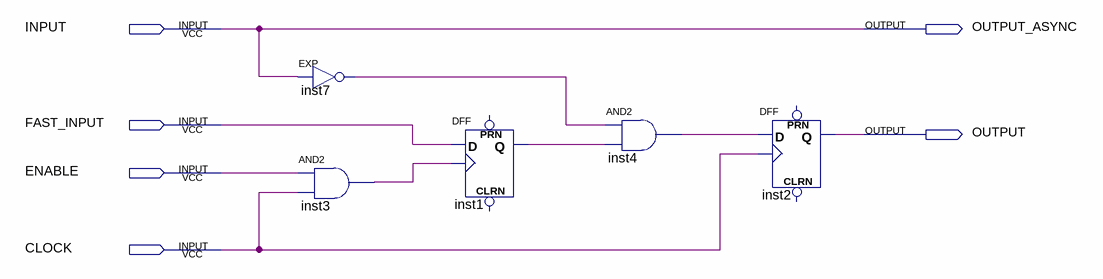
[diagram p0: schematic sheet]
// Quartus schematic TimingCompitoB.bdf as structural Verilog: 5 symbols, 6 pins
module TimingCompitoB (
  input  INPUT,
  input  FAST_INPUT,
  input  ENABLE,
  input  CLOCK,
  output OUTPUT_ASYNC,
  output OUTPUT
);

  wire inst1_q, inst3_out, inst4_out, inst7_out;

  EXP inst7 (.IN(INPUT), .OUT(inst7_out));
  and inst3 (inst3_out, ENABLE, CLOCK);
  DFF inst1 (.CLK(inst3_out), .D(FAST_INPUT), .Q(inst1_q));  // open: CLRN, PRN
  and inst4 (inst4_out, inst7_out, inst1_q);
  DFF inst2 (.CLK(CLOCK), .D(inst4_out), .Q(OUTPUT));  // open: CLRN, PRN

  assign OUTPUT_ASYNC = INPUT;
endmodule
